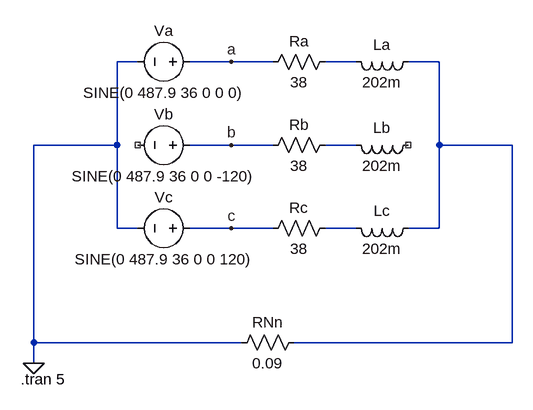
[diagram p0: schematic Star-star5.asc]
Star-star5.asc, the LTspice schematic file:
Version 4
SHEET 1 880 680
WIRE 112 -64 80 -64
WIRE 256 -64 192 -64
WIRE 320 -64 256 -64
WIRE 448 -64 400 -64
WIRE 576 -64 528 -64
WIRE 80 64 80 -64
WIRE 80 64 -48 64
WIRE 256 64 192 64
WIRE 320 64 256 64
WIRE 448 64 400 64
WIRE 576 64 576 -64
WIRE 688 64 576 64
WIRE 80 192 80 64
WIRE 112 192 80 192
WIRE 256 192 192 192
WIRE 320 192 256 192
WIRE 448 192 400 192
WIRE 576 192 576 64
WIRE 576 192 528 192
WIRE -48 368 -48 64
WIRE 272 368 -48 368
WIRE 688 368 688 64
WIRE 688 368 352 368
WIRE -48 400 -48 368
FLAG 256 -64 a
FLAG 256 64 b
FLAG 256 192 c
FLAG -48 400 0
SYMBOL voltage 208 -64 R90
WINDOW 0 -32 56 VBottom 2
WINDOW 3 32 56 VTop 2
WINDOW 123 0 0 Left 0
WINDOW 39 0 0 Left 0
SYMATTR InstName Va
SYMATTR Value SINE(0 487.9 36 0 0 0)
SYMBOL voltage 208 64 R90
WINDOW 0 -32 56 VBottom 2
WINDOW 3 32 56 VTop 2
WINDOW 123 0 0 Left 0
WINDOW 39 0 0 Left 0
SYMATTR InstName Vb
SYMATTR Value SINE(0 487.9 36 0 0 -120)
SYMBOL voltage 208 192 R90
WINDOW 0 -32 56 VBottom 2
WINDOW 3 32 56 VTop 2
WINDOW 123 0 0 Left 0
WINDOW 39 0 0 Left 0
SYMATTR InstName Vc
SYMATTR Value SINE(0 487.9 36 0 0 120)
SYMBOL res 416 -80 R90
WINDOW 0 0 56 VBottom 2
WINDOW 3 32 56 VTop 2
SYMATTR InstName Ra
SYMATTR Value 38
SYMBOL res 416 48 R90
WINDOW 0 0 56 VBottom 2
WINDOW 3 32 56 VTop 2
SYMATTR InstName Rb
SYMATTR Value 38
SYMBOL res 416 176 R90
WINDOW 0 0 56 VBottom 2
WINDOW 3 32 56 VTop 2
SYMATTR InstName Rc
SYMATTR Value 38
SYMBOL ind 544 -80 R90
WINDOW 0 5 56 VBottom 2
WINDOW 3 32 56 VTop 2
SYMATTR InstName La
SYMATTR Value 202m
SYMBOL ind 544 48 R90
WINDOW 0 5 56 VBottom 2
WINDOW 3 32 56 VTop 2
SYMATTR InstName Lb
SYMATTR Value 202m
SYMBOL ind 544 176 R90
WINDOW 0 5 56 VBottom 2
WINDOW 3 32 56 VTop 2
SYMATTR InstName Lc
SYMATTR Value 202m
SYMBOL res 368 352 R90
WINDOW 0 0 56 VBottom 2
WINDOW 3 32 56 VTop 2
SYMATTR InstName RNn
SYMATTR Value 0.09
TEXT -68 424 Left 2 !.tran 5

The netlist it stands for:
* Star-star5.asc
Va a 0 SINE(0 487.9 36 0 0 0)
Vb b NC_01 SINE(0 487.9 36 0 0 -120)
Vc c 0 SINE(0 487.9 36 0 0 120)
Ra N001 a 38
Rb N003 b 38
Rc N004 c 38
La N002 N001 202m
Lb NC_02 N003 202m
Lc N002 N004 202m
RNn N002 0 0.09
.tran 5
.backanno
.end

* Results of the author's LTspice run, read from the files saved beside the schematic
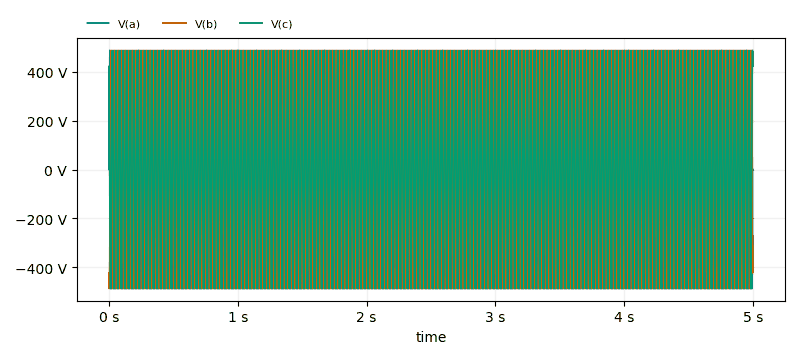
[diagram p1: Transient Analysis of Star-star5.asc, plotted from the saved traces]
* Transient Analysis, 1 run:
*   V(a): min -487.5 V, max 487.8 V, average -516.3 µV, rms 345.1 V, last 0 V
*   V(b): min -487.6 V, max 487.8 V, average 0 V, rms 345 V, last -422.5 V
*   V(c): min -487.8 V, max 487.4 V, average 488.3 µV, rms 344.9 V, last 422.5 V